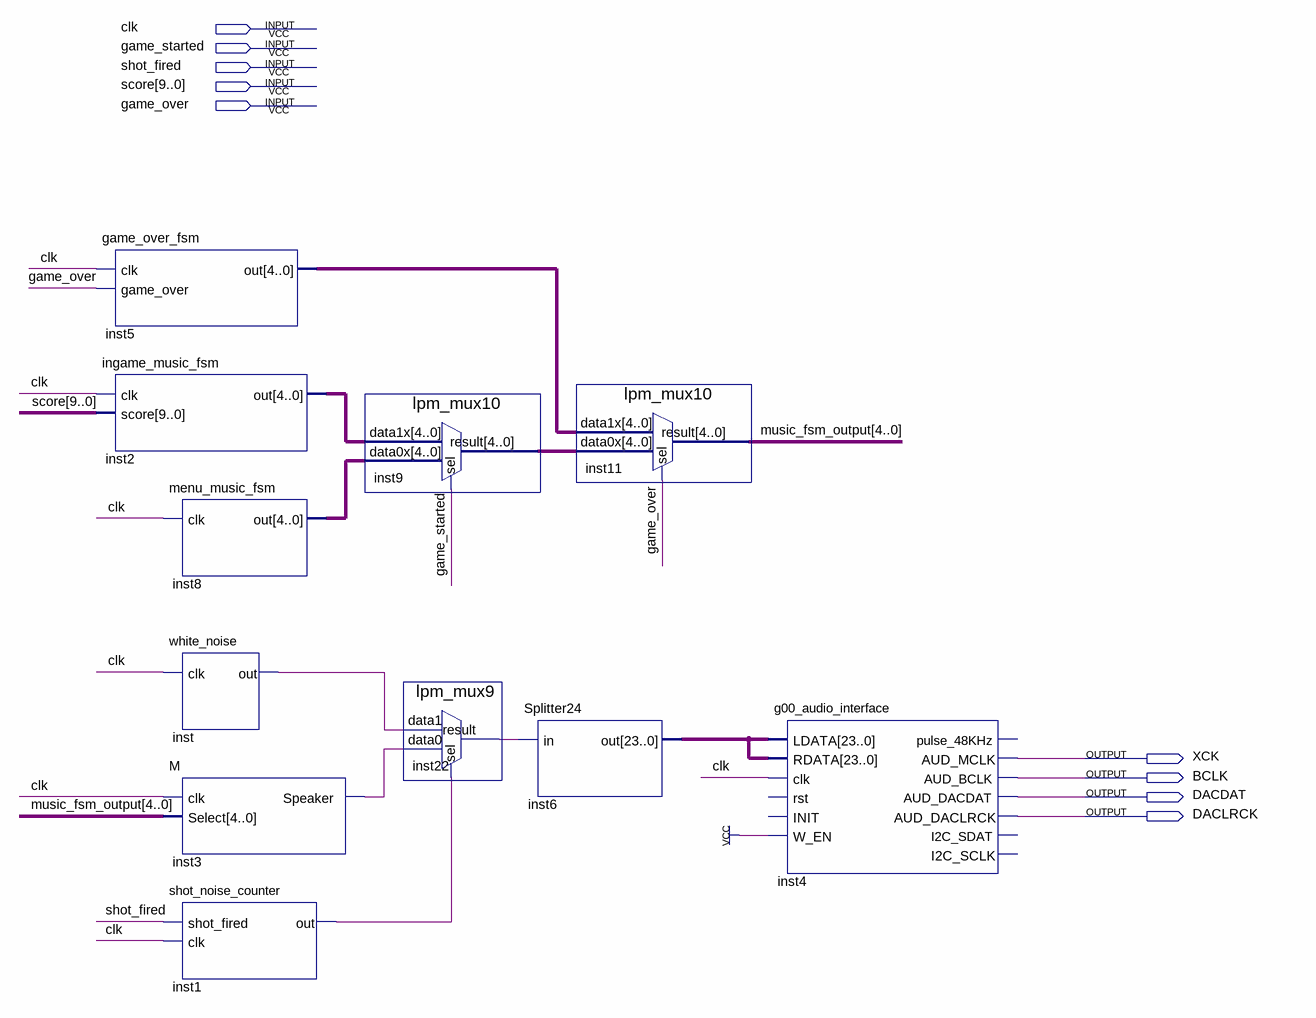
[diagram p0: schematic sheet]
// Quartus schematic sound_engine.bdf as structural Verilog: 11 symbols, 9 pins
module sound_engine (
  input  clk,
  input  game_started,
  input  shot_fired,
  input  [9:0] score,
  input  game_over,
  output XCK,
  output BCLK,
  output DACDAT,
  output DACLRCK
);

  wire inst1_out, inst3_speaker, inst22_result, inst_out;
  wire [4:0] inst2_out, inst5_out, inst8_out, inst9_result, music_fsm_output;
  wire [23:0] inst6_out;

  game_over_fsm inst5 (.clk(clk), .game_over(game_over), .out(inst5_out));
  ingame_music_fsm inst2 (.clk(clk), .score(score), .out(inst2_out));
  menu_music_fsm inst8 (.clk(clk), .out(inst8_out));
  white_noise inst (.clk(clk), .out(inst_out));
  M inst3 (.clk(clk), .Select(music_fsm_output), .Speaker(inst3_speaker));
  shot_noise_counter inst1 (.shot_fired(shot_fired), .clk(clk), .out(inst1_out));
  lpm_mux10 inst9 (.data1x(inst2_out), .data0x(inst8_out), .sel(game_started), .result(inst9_result));
  lpm_mux9 inst22 (.data1(inst_out), .data0(inst3_speaker), .sel(inst1_out), .result(inst22_result));
  Splitter24 inst6 (.in(inst22_result), .out(inst6_out));
  lpm_mux10 inst11 (.data1x(inst5_out), .data0x(inst9_result), .sel(game_over), .result(music_fsm_output));
  g00_audio_interface inst4 (
    .LDATA(inst6_out), .RDATA(inst6_out), .clk(clk), .W_EN(1'b1), .AUD_MCLK(XCK), .AUD_BCLK(BCLK),
    .AUD_DACDAT(DACDAT), .AUD_DACLRCK(DACLRCK));  // open: rst, INIT, pulse_48KHz, I2C_SDAT, I2C_SCLK
endmodule
